# Altium schematic sheet Signal_imputs.SchDoc: Signal_Imputs_SCH
size A4; Author: Hojnadel - Salazar, Ato; Revision: Rev1.0; SheetNumber: 3; SheetTotal: 6
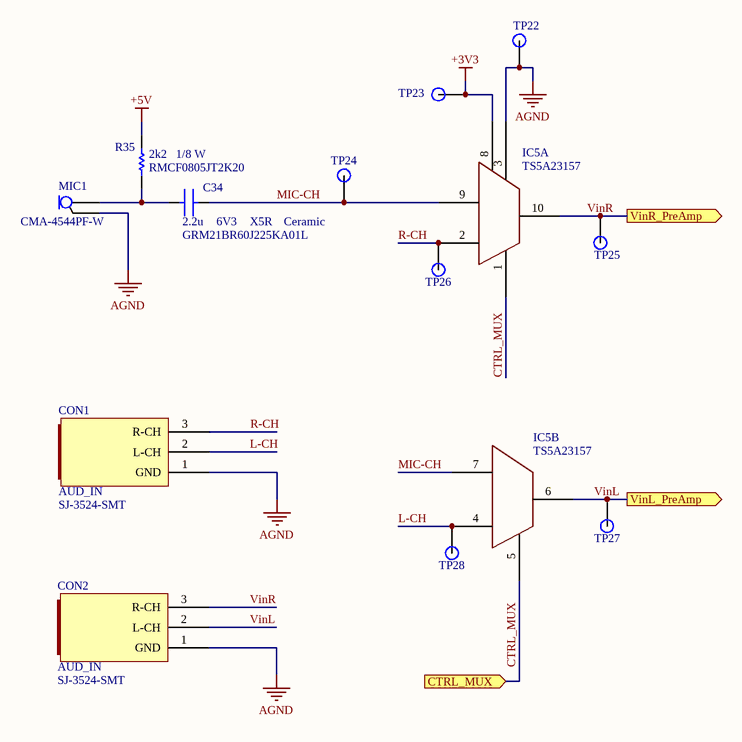
[diagram p0: Signal_imputs.SchDoc]

## Parts
C34  C: 2.2u  V: 6V3  Temp Coef: X5R  Part Number: GRM21BR60J225KA01L  Material: Ceramic  [C_0805]  (hidden comment: 2.2u 6V3 X5R Ceramic)
CON1  AUD_IN  Part Number: SJ-3524-SMT  [AUDIO_JACK 3.5mm SMD]
CON2  AUD_IN  Part Number: SJ-3524-SMT  [AUDIO_JACK 3.5mm SMD]
IC5  TS5A23157  [TSSOP50P490X110-10N]  (parts A,B of 2)
MIC1  Part Number: CMA-4544PF-W  [MIC_CMA-4544PF-W]  (hidden comment: Mic)
R35  value 2k2  Part Number: RMCF0805JT2K20  Power: 1/8 W  [R_0805]  (hidden comment: 2k2 1/8W)
TP22  TP  [TP]  (value not drawn)
TP23  TP  [TP]  (value not drawn)
TP24  TP  [TP]  (value not drawn)
TP25  TP  [TP]  (value not drawn)
TP26  TP  [TP]  (value not drawn)
TP27  TP  [TP]  (value not drawn)
TP28  TP  [TP]  (value not drawn)

## Ports
CTRL_MUX (in), VinL_PreAmp (out), VinR_PreAmp (out)

## Nets
+3V3: IC5.8(VDD) TP23.1
+5V: R35.2
AGND: CON1.1(GND) CON2.1(GND) IC5.3(DGND) MIC1.2 TP22.1
CTRL_MUX: IC5.1(IN1) IC5.5(IN2) ; port CTRL_MUX
L-CH: CON1.2(L-CH) IC5.4(NO2) TP28.1
MIC-CH: C34.2 IC5.7(NC2) IC5.9(NC1) TP24.1
R-CH: CON1.3(R-CH) IC5.2(NO1) TP26.1
VinL: CON2.2(L-CH) IC5.6(COM2) TP27.1 ; port VinL_PreAmp
VinR: CON2.3(R-CH) IC5.10(COM1) TP25.1 ; port VinR_PreAmp
NetC34_1: C34.1 MIC1.1 R35.1

## Library data of the parts
C34 = Cap1: Capacitor
CON1 CON2 = Jack_1
IC5 = A_SW_2x2:1_VSSOP: Analog Switch; Part Number: TS5A23157
MIC1 = Mic: Microfono
R35 = Res1: Resistor
TP22-TP28 = Test Point